# Altium schematic sheet Cording.SchDoc: Title
size A4; Date: *******; ApprovedBy: *******; CheckedBy: Yasiru; Author: *******; CompanyName: *******; DrawnBy: Name; Engineer: *******; Organization: *******; Address1: *******; Address2: *******; Address3: *******; Address4: *******; DocumentNumber: Doc Num; Revision: *******; SheetNumber: 2; SheetTotal: 11; Subtitle: UART Interface; Project: Resturant Robot; VersionRevision: III; TotalSheet: 11; CurrentTime: *******; CurrentDate: *******; Time: *******; DocumentFullPathAndName: *******; DocumentName: *******; ModifiedDate: *******; ImagePath: *******; ProjectName: *******; Application_BuildNumber: *******
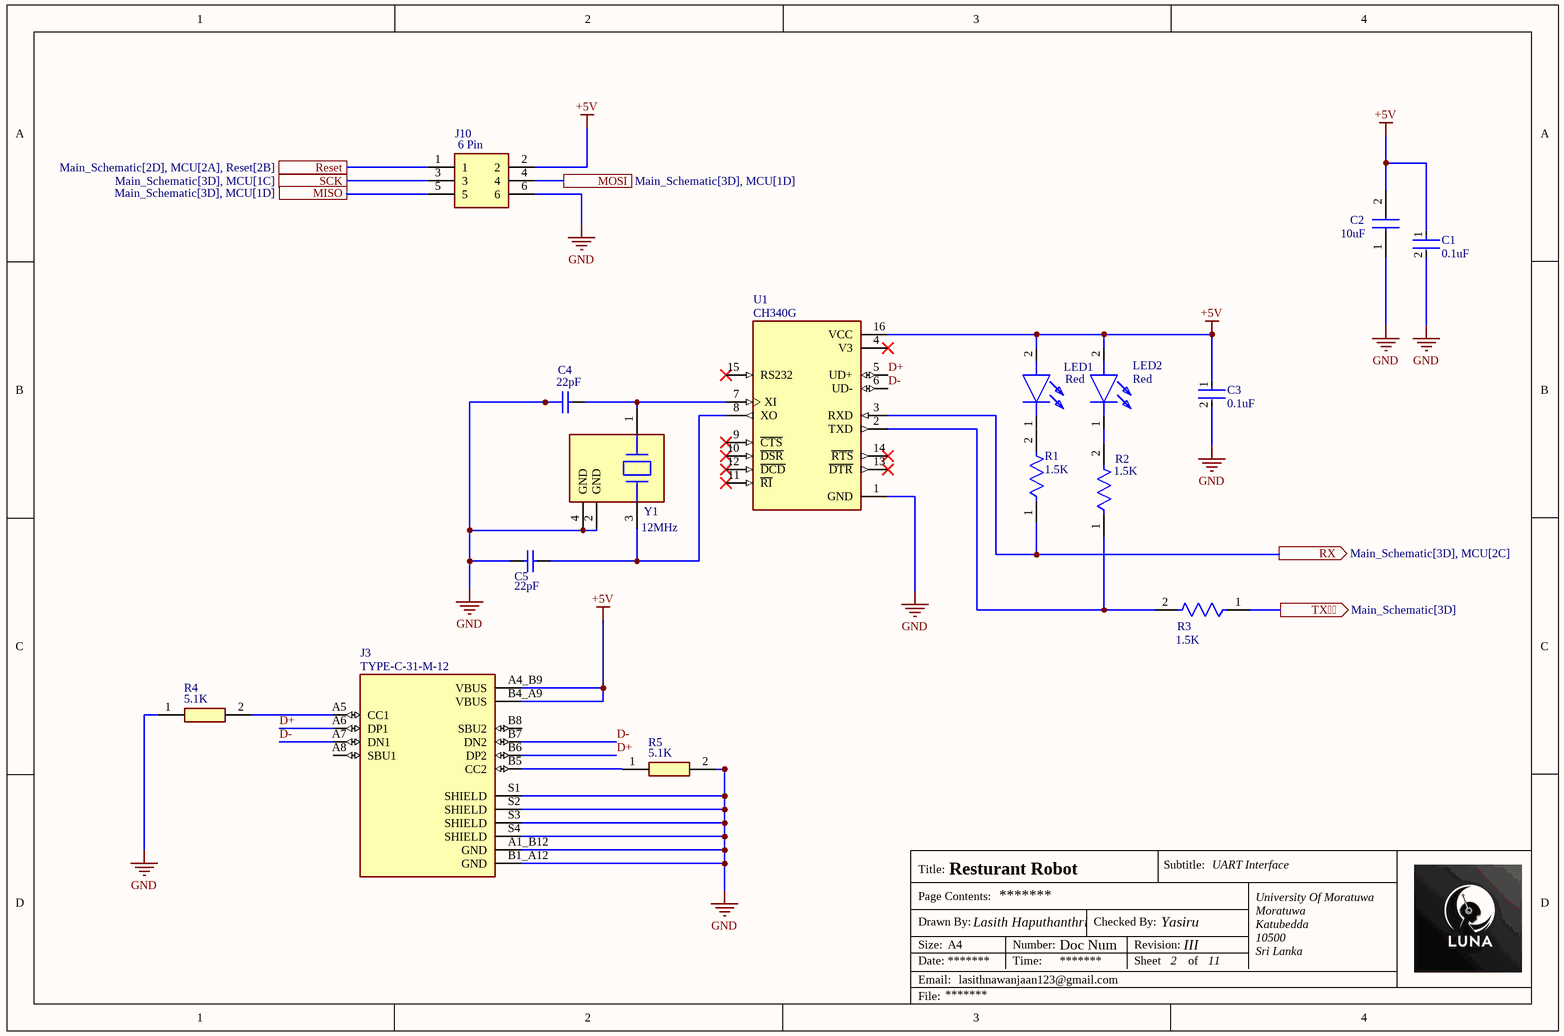
[diagram p0: Cording.SchDoc]

## Parts
C1  0.1uF  [FP-CC0603-DA-MFG]
C2  10uF  [CAPC1608X90N]
C3  0.1uF  [FP-CC0603-DA-MFG]
C4  22pF  [CAPC1608X90X40LL10T20]
C5  22pF  [CAPC1608X90X40LL10T20]
J3  TYPE-C-31-M-12  [HRO_TYPE-C-31-M-12]
J10  6 Pin  [HDRV6W64P254_2X3_762X508X868P]
LED1  Red  [LEDC1608X55N]
LED2  Red  [LEDC1608X55N]
R1  1.5K  [FP-AF0603-IPC_B]
R2  1.5K  [FP-AF0603-IPC_B]
R3  1.5K  [FP-AF0603-IPC_B]
R4  5.1K  [RESC1608X55N]
R5  5.1K  [RESC1608X55N]
U1  CH340G  [SOIC127P600X180-16N]
Y1  12MHz  [FP-ABM8G-MFG]

## Ports
MISO (see Main_Schematic[3D], MCU[1D]), MOSI (see Main_Schematic[3D], MCU[1D]), Reset (see Main_Schematic[2D], MCU[2A], Reset[2B]), RX (out, see Main_Schematic[3D], MCU[2C]), SCK (see Main_Schematic[3D], MCU[1C]), TX (out, see Main_Schematic[3D])

## Nets
+5V: C1.1 C2.2 C3.1 J3.A4_B9(VBUS) J3.B4_A9(VBUS) J10.2 LED1.2(A) LED2.2(A) U1.16(VCC)
GND: C1.2 C2.1 C3.2 C4.1 C5.1 J3.A1_B12(GND) J3.B1_A12(GND) J3.S1(SHIELD) J3.S2(SHIELD) J3.S3(SHIELD) J3.S4(SHIELD) J10.6 R4.1 R5.2 U1.1(GND) Y1.2(GND) Y1.4(GND)
D+: J3.A6(DP1) J3.B6(DP2) U1.5(UD+)
D-: J3.A7(DN1) J3.B7(DN2) U1.6(UD-)
MISO: J10.5 ; port MISO
MOSI: J10.4 ; port MOSI
Reset: J10.1 ; port Reset
RX: R1.1 U1.3(RXD) ; port RX
SCK: J10.3 ; port SCK
TX: R3.1 ; port TX
NetC4_2: C4.2 U1.7(XI) Y1.1
NetC5_2: C5.2 U1.8(XO) Y1.3
NetJ3_A5: J3.A5(CC1) R4.2
NetJ3_B5: J3.B5(CC2) R5.1
NetLED1_1: LED1.1(K) R1.2
NetLED2_1: LED2.1(K) R2.2
NetR2_1: R2.1 R3.2 U1.2(TXD)

Not connected (* = marked no-connect by the designer): J3 A8(SBU1) B8(SBU2); U1 4(V3)* 9(~{CTS})* 10(~{DSR})* 11(~{RI})* 12(~{DCD})* 13(~{DTR})* 14(~{RTS})* 15(RS232)*

## Notes on the sheet
- Title:
- Drawn By:
- Page Contents:
- Checked By:
- Subtitle:
- University Of Moratuwa
- Moratuwa
- Size:
- Date:
- File:
- Email:
- A4
- lasithnawanjaan123@gmail.com
- Lasith Haputhanthri
- Number:
- Time:
- Revision:
- Sheet
- of
- Katubedda
- 10500
- Sri Lanka

## Library data of the parts
C1 C3 = CMP-2100-03601-2: CC0603KRX7R9BB104 CAP CER 0.1UF 50V X7R 0603; Manufacturer: YAGEO; Material: Ceramic; Capacitance: 100 nF; Temperature Coefficient: 15%; Tolerance: 0.1; Value: 100 nF; Height: 0.9mm; Voltage: 50 V; ComponentLink2Description: Datasheet; Device Class L2: Capacitors; Temperature Range High: +125°C; Category: Cap; Footprint Url: http://www.yageo.com/exep/pages/download/literatures/UPY-C_GEN_24.pdf; ComponentLink2URL: http://www.yageo.com/documents/recent/UPY-GPHC_X7R_6.3V-to-50V_18.pdf; Package: CC0603-DA; Temperature: -55°C to +125°C; Voltage Rating: 50 V; Temperature Characteristic: X7R; Device Class L1: Passive Components; Temperature Range Low: -55°C; Manufacturer Part Number: CC0603KRX7R9BB104; RoHS: TRUE; Automotive: No; Device Class L3: Ceramic Capacitors; Octopart: https://octopart.com/cc0603krx7r9bb104-yageo-42244635; Mouser Description: Multilayer Ceramic Capacitor, CC Series, 0.1 - F, - 10%, X7R, 50 V, 0603 [1608 Metric]; Lead Free: Yes; Digikey Description: CAP CER 0.1UF 50V X7R 0603
C2 = CL10A106KP8NNNC: CL10A106KP8NNNC Capacitor; Manufacturer_Name: SAMSUNG; Datasheet Link: https://datasheet.datasheetarchive.com/originals/distributors/Datasheets-DGA10/2415998.pdf; Height: 0.9mm; Manufacturer_Part_Number: CL10A106KP8NNNC; Mouser Part Number: 187-CL10A106KP8NNNC; Mouser Price/Stock: https://www.mouser.co.uk/ProductDetail/Samsung-Electro-Mechanics/CL10A106KP8NNNC?qs=X6jEic%2FHinAlyfRHj7fKwg%3D%3D; Arrow Part Number: CL10A106KP8NNNC; Arrow Price/Stock: https://www.arrow.com/en/products/cl10a106kp8nnnc/samsung-electro-mechanics?region=europe
C4 C5 = CMP-1659-00026-1: CC0603JRNPO9BN220 Chip Capacitor, 22 pF, +/- 5%, 50 V, -55 to 125 degC, 0603 (1608 Metric), RoHS, Tape and Reel; ComponentLink1URL: http://www.yageo.com/; PackageReference: 0603; ComponentLink1Description: Manufacturer URL; PackageDescription: 2-Pin Surface Mount Device, Body 1.6 x 0.8 mm; DatasheetVersion: Rev. 8, 08/2011; ComponentLink2Description: Datasheet; ComponentLink2URL: http://www.yageo.com/documents/recent/UPY-GP_NP0_16V-to-50V_8.pdf
J3 = TYPE-C-31-M-12: USB Connectors 24 Receptacle 1 8.94*7.3mm RoHS; MF: HRO Electronics Co., Ltd.; Price: None; Value: *; SnapEDA_Link: https://www.snapeda.com/parts/TYPE-C-31-M-12/HRO+Electronics+Co.%252C+Ltd./view-part/?ref=snap; Package: Package; Availability: Not in stock; Check_prices: https://www.snapeda.com/parts/TYPE-C-31-M-12/HRO+Electronics+Co.%252C+Ltd./view-part/?ref=eda; MP: TYPE-C-31-M-12
J10 = M20-9980346: Connector; Manufacturer_Name: Harwin; Datasheet Link: https://cdn.harwin.com/pdfs/M20-998.pdf; Height: 8.68mm; Manufacturer_Part_Number: M20-9980346; Mouser Part Number: 855-M20-9980346; Mouser Price/Stock: https://www.mouser.co.uk/ProductDetail/Harwin/M20-9980346?qs=%252Bk6%2F5FB6qrmHk2P20oz3FA%3D%3D
LED1 LED2 = LTST-C191KRKT: LED; Manufacturer_Name: Lite-On; Datasheet Link: http://www.mouser.com/ds/2/239/S_110_LTST-C191KRKT-539838.pdf; Height: 0.55mm; Manufacturer_Part_Number: LTST-C191KRKT; Mouser Part Number: 859-LTST-C191KRKT; Mouser Price/Stock: https://www.mouser.co.uk/ProductDetail/Lite-On/LTST-C191KRKT?qs=BAIUz4Y8PJBLfOhzue0q%252BA%3D%3D; Arrow Part Number: LTST-C191KRKT; Arrow Price/Stock: https://www.arrow.com/en/products/ltst-c191krkt/lite-on-technology?region=nac
R1-R3 = CMP-03412-043191-1: AF0603FR-071K5L Anti-Sulfurated Chip Resistors Automotive Grade 1.5kΩ 1% 100ppm/°C 0603; Resistance: 1.5kR; Max Power Dissipation: 100mW; Length: 0.063inch; Packaging: Tape and Reel; Tolerance: 1%; RoHS Compliant: Yes; Series: AF; Temperature Coefficient: 100ppm/°C; Case/Package: 0603; Height: 0.022inch; Min Operating Temperature: -55°C; Resistor Type: Thick Film; Features: Moisture Resistant; Width: 0.031inch; Number of Terminations: 2; Max Operating Temperature: 155°C
R4 = 0603WAF5101T5E: 0603WAF5101T5E Resistor; Manufacturer_Name: UNI-ROYAL(Uniroyal Elec); Datasheet Link: https://datasheet.lcsc.com/szlcsc/Uniroyal-Elec-0603WAF5101T5E_C23186.pdf; Height: 0.55mm; Manufacturer_Part_Number: 0603WAF5101T5E
R5 = 0603WAF5101T5E: 0603WAF5101T5EResistor; Manufacturer_Name: UNI-ROYAL(Uniroyal Elec); Datasheet Link: https://datasheet.lcsc.com/szlcsc/Uniroyal-Elec-0603WAF5101T5E_C23186.pdf; Height: 0.55mm; Manufacturer_Part_Number: 0603WAF5101T5E
U1 = CH340G: USB Interface Integrated Circuit; MF: WCH; Value: *; SnapEDA_Link: https://www.snapeda.com/parts/Ch340G/WCH/view-part/?ref=snap; MP: Ch340G; Check_prices: https://www.snapeda.com/parts/Ch340G/WCH/view-part/?ref=eda; Availability: Not in stock; Price: None; Package: None
Y1 = CMP-2000-05039-3: ABM8G-12.000MHZ-18-D2Y-T Crystal 12MHz ±20ppm (Tol) ±30ppm (Stability) 18pF FUND 120Ω 4-Pin SMD T/R; Series Resistance: 120R; Max Operating Temperature: 85°C; Mount: Surface Mount; Width: 2.5mm; Series: ABM8G; Termination: SMD/SMT; Frequency Tolerance: 20ppm; Tolerance: 20ppm; Min Operating Temperature: -40°C; Operating Frequency: 12 MHz; Depth: 2.5mm; Load Capacitance: 18pF; Number of Pins: 4; Length: 3.2mm; Radiation Hardening: No; Frequency Stability: 30ppm; Height: 1mm; Packaging: Tape and Reel; Package Quantity: 1000; ESR (Equivalent Series Resistance): 120R; Lead Free: Lead Free; Frequency: 12MHz; Case/Package: CSMD